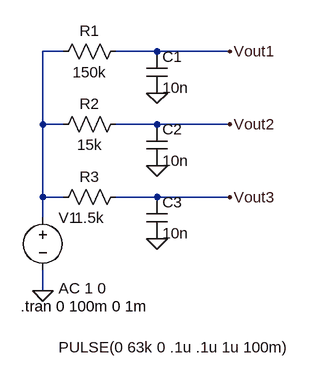
[diagram p0: schematic Lab1_1.asc]
Lab1_1.asc, the LTspice schematic file:
Version 4
SHEET 1 880 680
WIRE 96 128 64 128
WIRE 240 128 176 128
WIRE 352 128 240 128
WIRE 64 240 64 128
WIRE 96 240 64 240
WIRE 240 240 176 240
WIRE 352 240 240 240
WIRE 64 352 64 240
WIRE 96 352 64 352
WIRE 240 352 176 352
WIRE 352 352 240 352
WIRE 64 384 64 352
WIRE 64 496 64 464
FLAG 64 496 0
FLAG 240 192 0
FLAG 240 304 0
FLAG 240 416 0
FLAG 352 128 Vout1
FLAG 352 240 Vout2
FLAG 352 352 Vout3
SYMBOL res 192 112 R90
WINDOW 0 0 56 VBottom 2
WINDOW 3 32 56 VTop 2
SYMATTR InstName R1
SYMATTR Value 150k
SYMBOL res 192 224 R90
WINDOW 0 0 56 VBottom 2
WINDOW 3 32 56 VTop 2
SYMATTR InstName R2
SYMATTR Value 15k
SYMBOL res 192 336 R90
WINDOW 0 0 56 VBottom 2
WINDOW 3 32 56 VTop 2
SYMATTR InstName R3
SYMATTR Value 1.5k
SYMBOL cap 224 128 R0
SYMATTR InstName C1
SYMATTR Value 10n
SYMBOL cap 224 240 R0
SYMATTR InstName C2
SYMATTR Value 10n
SYMBOL cap 224 352 R0
SYMATTR InstName C3
SYMATTR Value 10n
SYMBOL voltage 64 368 R0
WINDOW 3 24 215 Left 2
WINDOW 123 24 124 Left 2
WINDOW 39 0 0 Left 0
SYMATTR InstName V1
SYMATTR Value PULSE(0 63k 0 .1u .1u 1u 100m)
SYMATTR Value2 AC 1 0
TEXT 30 520 Left 2 !.tran 0 100m 0 1m

The netlist it stands for:
* Lab1_1.asc
R1 Vout1 N001 150k
R2 Vout2 N001 15k
R3 Vout3 N001 1.5k
C1 Vout1 0 10n
C2 Vout2 0 10n
C3 Vout3 0 10n
V1 N001 0 PULSE(0 63k 0 .1u .1u 1u 100m) AC 1 0
.tran 0 100m 0 1m
.backanno
.end